# Altium project IGBT_Module_Driver.PrjPcb
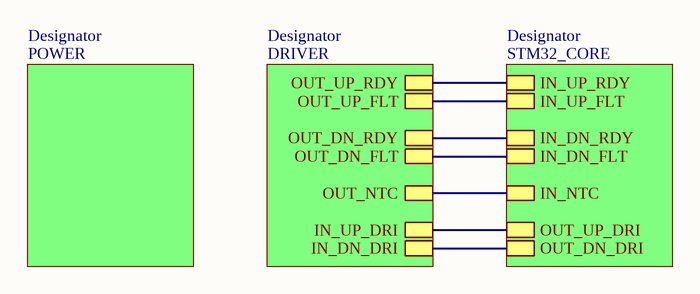
[diagram p0: Top.SchDoc]
4 sheets, 230 parts. Net scope: hierarchical (ports join the sheet entries above them; power ports are global).
Board file: MODULE_DRIVER.PcbDoc
Sheets:
  Top.SchDoc
    Designator = DRIVER.SchDoc
    Designator = STM32_CORE.SchDoc
    Designator = POWER.SchDoc

## Sheet Top.SchDoc
size A4; SheetNumber: 1; SheetTotal: 4

### Sub-sheets
Designator = DRIVER: OUT_UP_RDY, OUT_UP_FLT, OUT_DN_RDY, OUT_DN_FLT, OUT_NTC, IN_UP_DRI, IN_DN_DRI
Designator = STM32_CORE: IN_UP_RDY, IN_UP_FLT, IN_DN_RDY, IN_DN_FLT, IN_NTC, OUT_UP_DRI, OUT_DN_DRI
Designator = POWER: no entries

### Nets
ADC1_IN4: sheet Designator/OUT_NTC, sheet Designator/IN_NTC
DN_DRI: sheet Designator/IN_DN_DRI, sheet Designator/OUT_DN_DRI
DN_FLT: sheet Designator/OUT_DN_FLT, sheet Designator/IN_DN_FLT
DN_RDY: sheet Designator/OUT_DN_RDY, sheet Designator/IN_DN_RDY
GPI_U_FLT: sheet Designator/OUT_UP_FLT, sheet Designator/IN_UP_FLT
GPI_U_RDY: sheet Designator/OUT_UP_RDY, sheet Designator/IN_UP_RDY
OP_RX: sheet Designator/IN_UP_DRI, sheet Designator/OUT_UP_DRI

## Sheet DRIVER.SchDoc
size A3; SheetNumber: 3; SheetTotal: 4
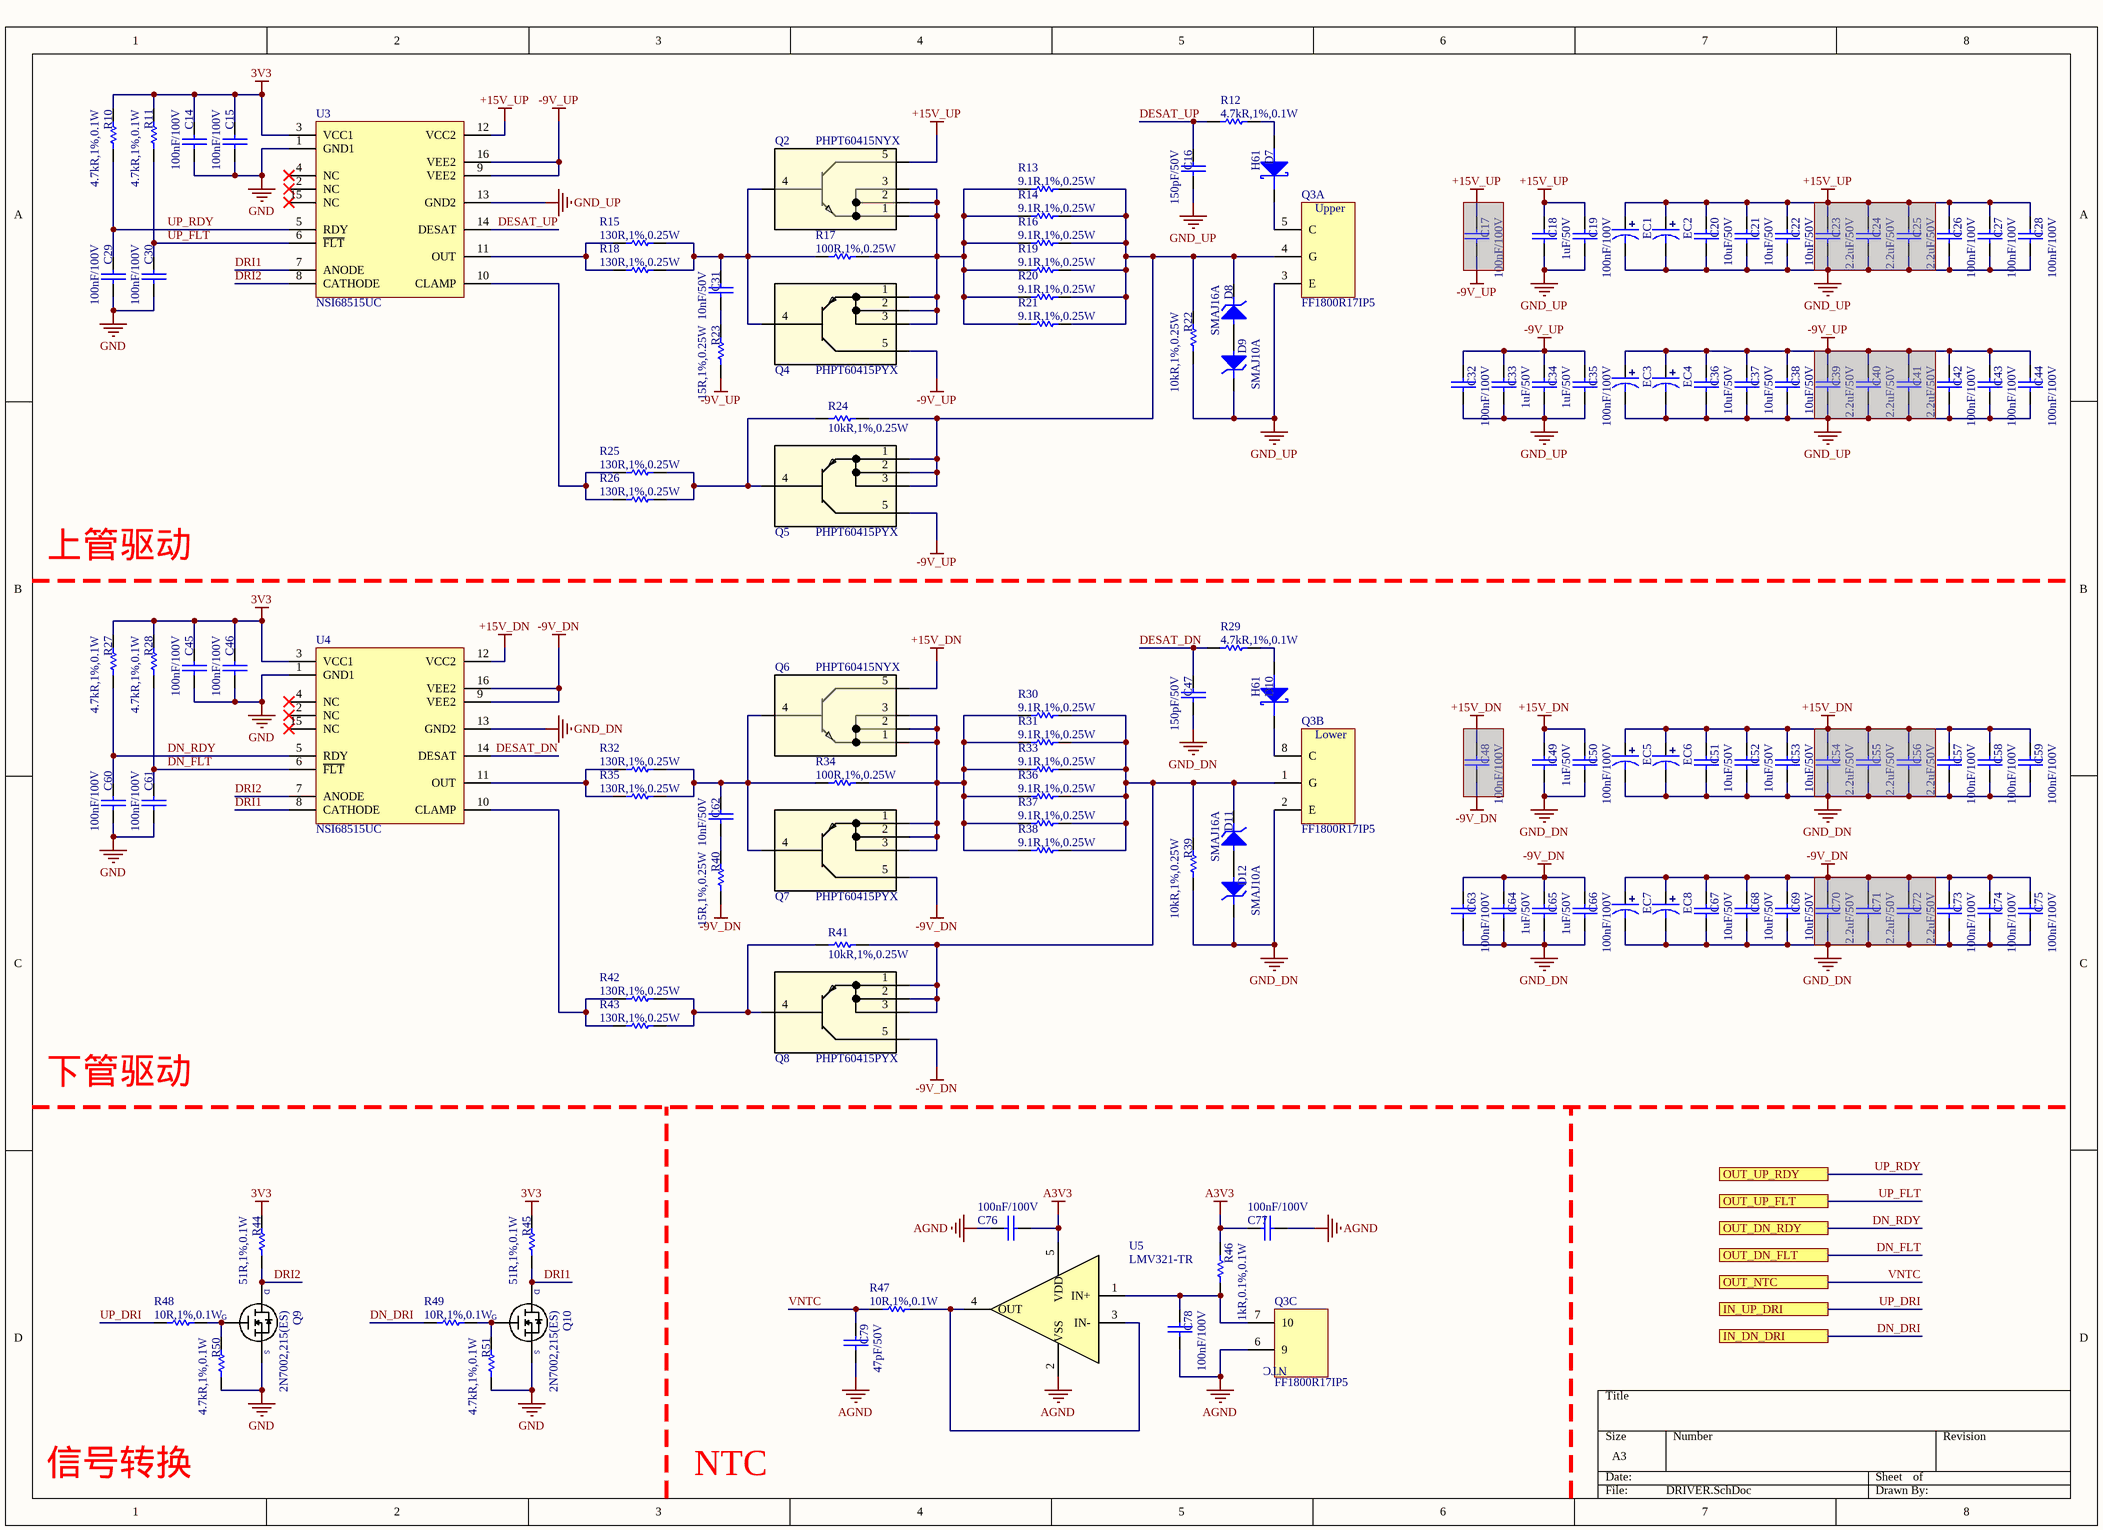
[diagram p1: DRIVER.SchDoc]

### Parts
C14  100nF/100V  [0603C]
C15  100nF/100V  [0603C]
C16  150pF/50V  [0603C]
C17  100nF/100V  [1206C]  (masked out: inside a compile mask, not in the netlist)
C18  1uF/50V  [0603C]
C19  100nF/100V  [0603C]
C20  10uF/50V  [1206C]
C21  10uF/50V  [1206C]
C22  10uF/50V  [1206C]
C23  2.2uF/50V  [1206C]  (masked out: inside a compile mask, not in the netlist)
C24  2.2uF/50V  [1206C]  (masked out: inside a compile mask, not in the netlist)
C25  2.2uF/50V  [1206C]  (masked out: inside a compile mask, not in the netlist)
C26  100nF/100V  [1206C]
C27  100nF/100V  [1206C]
C28  100nF/100V  [1206C]
C29  100nF/100V  [0603C]
C30  100nF/100V  [0603C]
C31  10nF/50V  [1206C]
C32  100nF/100V  [0603C]
C33  1uF/50V  [0603C]
C34  1uF/50V  [0603C]
C35  100nF/100V  [0603C]
C36  10uF/50V  [1206C]
C37  10uF/50V  [1206C]
C38  10uF/50V  [1206C]
C39  2.2uF/50V  [1206C]  (masked out: inside a compile mask, not in the netlist)
C40  2.2uF/50V  [1206C]  (masked out: inside a compile mask, not in the netlist)
C41  2.2uF/50V  [1206C]  (masked out: inside a compile mask, not in the netlist)
C42  100nF/100V  [1206C]
C43  100nF/100V  [1206C]
C44  100nF/100V  [1206C]
C45  100nF/100V  [0603C]
C46  100nF/100V  [0603C]
C47  150pF/50V  [0603C]
C48  100nF/100V  [1206C]  (masked out: inside a compile mask, not in the netlist)
C49  1uF/50V  [0603C]
C50  100nF/100V  [0603C]
C51  10uF/50V  [1206C]
C52  10uF/50V  [1206C]
C53  10uF/50V  [1206C]
C54  2.2uF/50V  [1206C]  (masked out: inside a compile mask, not in the netlist)
C55  2.2uF/50V  [1206C]  (masked out: inside a compile mask, not in the netlist)
C56  2.2uF/50V  [1206C]  (masked out: inside a compile mask, not in the netlist)
C57  100nF/100V  [1206C]
C58  100nF/100V  [1206C]
C59  100nF/100V  [1206C]
C60  100nF/100V  [0603C]
C61  100nF/100V  [0603C]
C62  10nF/50V  [1206C]
C63  100nF/100V  [0603C]
C64  1uF/50V  [0603C]
C65  1uF/50V  [0603C]
C66  100nF/100V  [0603C]
C67  10uF/50V  [1206C]
C68  10uF/50V  [1206C]
C69  10uF/50V  [1206C]
C70  2.2uF/50V  [1206C]  (masked out: inside a compile mask, not in the netlist)
C71  2.2uF/50V  [1206C]  (masked out: inside a compile mask, not in the netlist)
C72  2.2uF/50V  [1206C]  (masked out: inside a compile mask, not in the netlist)
C73  100nF/100V  [1206C]
C74  100nF/100V  [1206C]
C75  100nF/100V  [1206C]
C76  100nF/100V  [0603C]
C77  100nF/100V  [0603C]
C78  100nF/100V  [0603C]
C79  47pF/50V  [0603C]
D7  H61  [SOD-123]
D8  SMAJ16A  [SMA/DO-214AC]
D9  SMAJ10A  [SMA/DO-214AC]
D10  H61  [SOD-123]
D11  SMAJ16A  [SMA/DO-214AC]
D12  SMAJ10A  [SMA/DO-214AC]
EC1  MA25V470M8x10  [CAPAE830X1050L275X95N]  (value not drawn)
EC2  MA25V470M8x10  [CAPAE830X1050L275X95N]  (value not drawn)
EC3  MA25V470M8x10  [CAPAE830X1050L275X95N]  (value not drawn)
EC4  MA25V470M8x10  [CAPAE830X1050L275X95N]  (value not drawn)
EC5  MA25V470M8x10  [CAPAE830X1050L275X95N]  (value not drawn)
EC6  MA25V470M8x10  [CAPAE830X1050L275X95N]  (value not drawn)
EC7  MA25V470M8x10  [CAPAE830X1050L275X95N]  (value not drawn)
EC8  MA25V470M8x10  [CAPAE830X1050L275X95N]  (value not drawn)
Q2  PHPT60415NYX  [LFPAK56_SOT669_NEX]
Q3  FF1800R17IP5  [FF1800R17IP5]  (parts A,B,C of 3)
Q4  PHPT60415PYX  [LFPAK56_SOT669_NEX]
Q5  PHPT60415PYX  [LFPAK56_SOT669_NEX]
Q6  PHPT60415NYX  [LFPAK56_SOT669_NEX]
Q7  PHPT60415PYX  [LFPAK56_SOT669_NEX]
Q8  PHPT60415PYX  [LFPAK56_SOT669_NEX]
Q9  2N7002,215(ES)  [SOT23]
Q10  2N7002,215(ES)  [SOT23]
R10  4.7kR,1%,0.1W  [0603R]
R11  4.7kR,1%,0.1W  [0603R]
R12  4.7kR,1%,0.1W  [0603R]
R13  9.1R,1%,0.25W  [1206R]
R14  9.1R,1%,0.25W  [1206R]
R15  130R,1%,0.25W  [1206R]
R16  9.1R,1%,0.25W  [1206R]
R17  100R,1%,0.25W  [1206R]
R18  130R,1%,0.25W  [1206R]
R19  9.1R,1%,0.25W  [1206R]
R20  9.1R,1%,0.25W  [1206R]
R21  9.1R,1%,0.25W  [1206R]
R22  10kR,1%,0.25W  [1206R]
R23  15R,1%,0.25W  [1206R]
R24  10kR,1%,0.25W  [1206R]
R25  130R,1%,0.25W  [1206R]
R26  130R,1%,0.25W  [1206R]
R27  4.7kR,1%,0.1W  [0603R]
R28  4.7kR,1%,0.1W  [0603R]
R29  4.7kR,1%,0.1W  [0603R]
R30  9.1R,1%,0.25W  [1206R]
R31  9.1R,1%,0.25W  [1206R]
R32  130R,1%,0.25W  [1206R]
R33  9.1R,1%,0.25W  [1206R]
R34  100R,1%,0.25W  [1206R]
R35  130R,1%,0.25W  [1206R]
R36  9.1R,1%,0.25W  [1206R]
R37  9.1R,1%,0.25W  [1206R]
R38  9.1R,1%,0.25W  [1206R]
R39  10kR,1%,0.25W  [1206R]
R40  15R,1%,0.25W  [1206R]
R41  10kR,1%,0.25W  [1206R]
R42  130R,1%,0.25W  [1206R]
R43  130R,1%,0.25W  [1206R]
R44  51R,1%,0.1W  [0603R]
R45  51R,1%,0.1W  [0603R]
R46  1kR,0.1%,0.1W  [0603R]
R47  10R,1%,0.1W  [0603R]
R48  10R,1%,0.1W  [0603R]
R49  10R,1%,0.1W  [0603R]
R50  4.7kR,1%,0.1W  [0603R]
R51  4.7kR,1%,0.1W  [0603R]
U3  NSI68515UC  [SOIC16P127_1030X1030X265L70X39N]
U4  NSI68515UC  [SOIC16P127_1030X1030X265L70X39N]
U5  LMV321-TR  [SOT23-5P95_292X280X125L45X40N]

### Ports
IN_DN_DRI (see Top[2B]), IN_UP_DRI (see Top[2B]), OUT_DN_FLT (see Top[2B]), OUT_DN_RDY (see Top[2B]), OUT_NTC (see Top[2B]), OUT_UP_FLT (see Top[2A]), OUT_UP_RDY (see Top[2A])

### Nets
3V3: C14.1 C15.1 C45.1 C46.1 R10.2 R11.2 R27.2 R28.2 R44.1 R45.1 U3.3(VCC1) U4.3(VCC1)
+15V_DN: C49.2 C50.1 Q6.5(COLLECTOR) U4.12(VCC2)
+15V_UP: C18.2 C19.1 Q2.5(COLLECTOR) U3.12(VCC2)
-9V_DN: C63.1 C64.2 C65.2 C66.1 Q7.5(COLLECTOR) Q8.5(COLLECTOR) R40.1 U4.9(VEE2) U4.16(VEE2)
-9V_UP: C32.1 C33.2 C34.2 C35.1 Q4.5(COLLECTOR) Q5.5(COLLECTOR) R23.1 U3.9(VEE2) U3.16(VEE2)
A3V3: C76.2 C77.1 R46.2 U5.5(VDD)
AGND: C76.1 C77.2 C78.1 C79.1 Q3.6(9) U5.2(VSS)
GND: C14.2 C15.2 C29.1 C30.1 C45.2 C46.2 C60.1 C61.1 Q9.3 Q10.3 R50.1 R51.1 U3.1(GND1) U4.1(GND1)
GND_DN: C47.1 C49.1 C50.2 C63.2 C64.1 C65.1 C66.2 D12.K Q3.2(E) R39.1 U4.13(GND2)
GND_UP: C16.1 C18.1 C19.2 C32.2 C33.1 C34.1 C35.2 D9.K Q3.3(E) R22.1 U3.13(GND2)
DESAT_DN: C47.2 R29.2 U4.14(DESAT)
DESAT_UP: C16.2 R12.2 U3.14(DESAT)
DN_DRI: R49.2 ; port IN_DN_DRI
DN_FLT: C61.2 R28.1 U4.6(~{FLT}) ; port OUT_DN_FLT
DN_RDY: C60.2 R27.1 U4.5(RDY) ; port OUT_DN_RDY
DRI1: Q10.2 R45.2 U3.7(ANODE) U4.8(CATHODE)
DRI2: Q9.2 R44.2 U3.8(CATHODE) U4.7(ANODE)
UP_DRI: R48.2 ; port IN_UP_DRI  [project net OP_RX]
UP_FLT: C30.2 R11.1 U3.6(~{FLT}) ; port OUT_UP_FLT  [project net GPI_U_FLT]
UP_RDY: C29.2 R10.1 U3.5(RDY) ; port OUT_UP_RDY  [project net GPI_U_RDY]
VNTC: C79.2 R47.2 ; port OUT_NTC  [project net ADC1_IN4]
NetC20_1: C20.1 C21.1 C22.1 C26.1 C27.1 C28.1 EC1.2 EC2.2
NetC20_2: C20.2 C21.2 C22.2 C26.2 C27.2 C28.2 EC1.1 EC2.1
NetC31_1: C31.1 R23.2
NetC31_2: C31.2 Q2.4(BASE) Q4.4(BASE) R15.2 R17.1 R18.2
NetC36_1: C36.1 C37.1 C38.1 C42.1 C43.1 C44.1 EC3.2 EC4.2
NetC36_2: C36.2 C37.2 C38.2 C42.2 C43.2 C44.2 EC3.1 EC4.1
NetC51_1: C51.1 C52.1 C53.1 C57.1 C58.1 C59.1 EC5.2 EC6.2
NetC51_2: C51.2 C52.2 C53.2 C57.2 C58.2 C59.2 EC5.1 EC6.1
NetC62_1: C62.1 R40.2
NetC62_2: C62.2 Q6.4(BASE) Q7.4(BASE) R32.2 R34.1 R35.2
NetC67_1: C67.1 C68.1 C69.1 C73.1 C74.1 C75.1 EC7.2 EC8.2
NetC67_2: C67.2 C68.2 C69.2 C73.2 C74.2 C75.2 EC7.1 EC8.1
NetC78_2: C78.2 Q3.7(10) R46.1 U5.1(IN+)
NetD7_A: D7.A R12.1
NetD7_K: D7.K Q3.5(C)
NetD8_A: D8.A D9.A
NetD8_K: D8.K Q3.4(G) Q5.1(EMITTER) Q5.2(EMITTER) Q5.3(EMITTER) R13.2 R14.2 R16.2 R19.2 R20.2 R21.2 R22.2 R24.1
NetD10_A: D10.A R29.1
NetD10_K: D10.K Q3.8(C)
NetD11_A: D11.A D12.A
NetD11_K: D11.K Q3.1(G) Q8.1(EMITTER) Q8.2(EMITTER) Q8.3(EMITTER) R30.2 R31.2 R33.2 R36.2 R37.2 R38.2 R39.2 R41.1
NetQ2_1: Q2.1(EMITTER) Q2.2(EMITTER) Q2.3(EMITTER) Q4.1(EMITTER) Q4.2(EMITTER) Q4.3(EMITTER) R13.1 R14.1 R16.1 R17.2 R19.1 R20.1 R21.1
NetQ5_4: Q5.4(BASE) R24.2 R25.2 R26.2
NetQ6_1: Q6.1(EMITTER) Q6.2(EMITTER) Q6.3(EMITTER) Q7.1(EMITTER) Q7.2(EMITTER) Q7.3(EMITTER) R30.1 R31.1 R33.1 R34.2 R36.1 R37.1 R38.1
NetQ8_4: Q8.4(BASE) R41.2 R42.2 R43.2
NetQ9_1: Q9.1 R48.1 R50.2
NetQ10_1: Q10.1 R49.1 R51.2
NetR15_1: R15.1 R18.1 U3.11(OUT)
NetR25_1: R25.1 R26.1 U3.10(CLAMP)
NetR32_1: R32.1 R35.1 U4.11(OUT)
NetR42_1: R42.1 R43.1 U4.10(CLAMP)
NetR47_1: R47.1 U5.3(IN-) U5.4(OUT)

Not connected (* = marked no-connect by the designer): U3 2(NC)* 4(NC)* 15(NC)*; U4 2(NC)* 4(NC)* 15(NC)*

### Notes on the sheet
- 上管驱动
- 下管驱动
- 信号转换
- NTC
- (in symbol FF1800R17IP5, part A) Upper
- (in symbol FF1800R17IP5, part B) Lower
- (in symbol FF1800R17IP5, part C) NTC
- (in symbol MOS-3P) D; G; S

### Library data of the parts
C14 C15 C19 C29 C30 C32 C35 C45 C46 C50 C60 C61 C63 C66 C76-C78 = CAP: CC0603KRX7R9BB104
C16 C47 = CAP: CC0603KRX7R9BB151
C17 C26-C28 C42-C44 C48 C57-C59 C73-C75 = CAP: CC1206KKX7R0BB104
C18 C33 C34 C49 C64 C65 = CAP: CC0603KRX7R9BB105
C20-C22 C36-C38 C51-C53 C67-C69 = CAP: CC1206KKX5R9BB106
C23-C25 C39-C41 C54-C56 C70-C72 = CAP: CC1206KKX7R9BB225
C31 C62 = CAP: CC1206KRX7R9BB103
C79 = CAP: CC0603FRNPO9BN470
D7 D10 = DIODE SCHOTTKY: 1.1V@1.0A，耐压1.6kV，trr=70ns
D8 D9 D11 D12 = TVS: 单向瞬态抑制二极管
EC1-EC8 = SMD_ECAP: 470uF@25V， Iripple = 4.1A
Q2 Q6 = PHPT60415NYX: No Description Available; Manufacturer_Name: Nexperia; Manufacturer_Part_Number: PHPT60410NYX; Type: Transistors; Copyright: Copyright (C) 2025 Ultra Librarian. All rights reserved.; RefDes: RefDes
Q3 = FF1800R17IP5: IGBT Module
Q4 Q5 Q7 Q8 = PHPT60415PYX: No Description Available; Manufacturer_Name: Nexperia; Type: Transistors; Copyright: Copyright (C) 2025 Ultra Librarian. All rights reserved.; Manufacturer_Part_Number: PHPT60415PYX; RefDes: RefDes
Q9 Q10 = MOS-3P
R10-R12 R27-R29 R47-R51 = RES: RC0603FR-074K7L
R13 R14 R16 R19-R21 R30 R31 R33 R36-R38 = RES: RC1206FR-079R1L
R15 R18 R25 R26 R32 R35 R42 R43 = RES: RC1206FR-07130RL
R17 R34 = RES: RC1206FR-07100RL
R22 R24 R39 R41 = RES: RC1206FR-0710KL
R23 R40 = RES: RC1206FR-0715RL
R44 R45 = RES: RC0603FR-0751RL
R46 = RES: RT0603BRD071KL
U3 U4 = NSI68515UC: Driver IC
U5 = LMV321-TR: 轨到轨运算放大器

## Sheet STM32_CORE.SchDoc
size A4; SheetNumber: 2; SheetTotal: 4
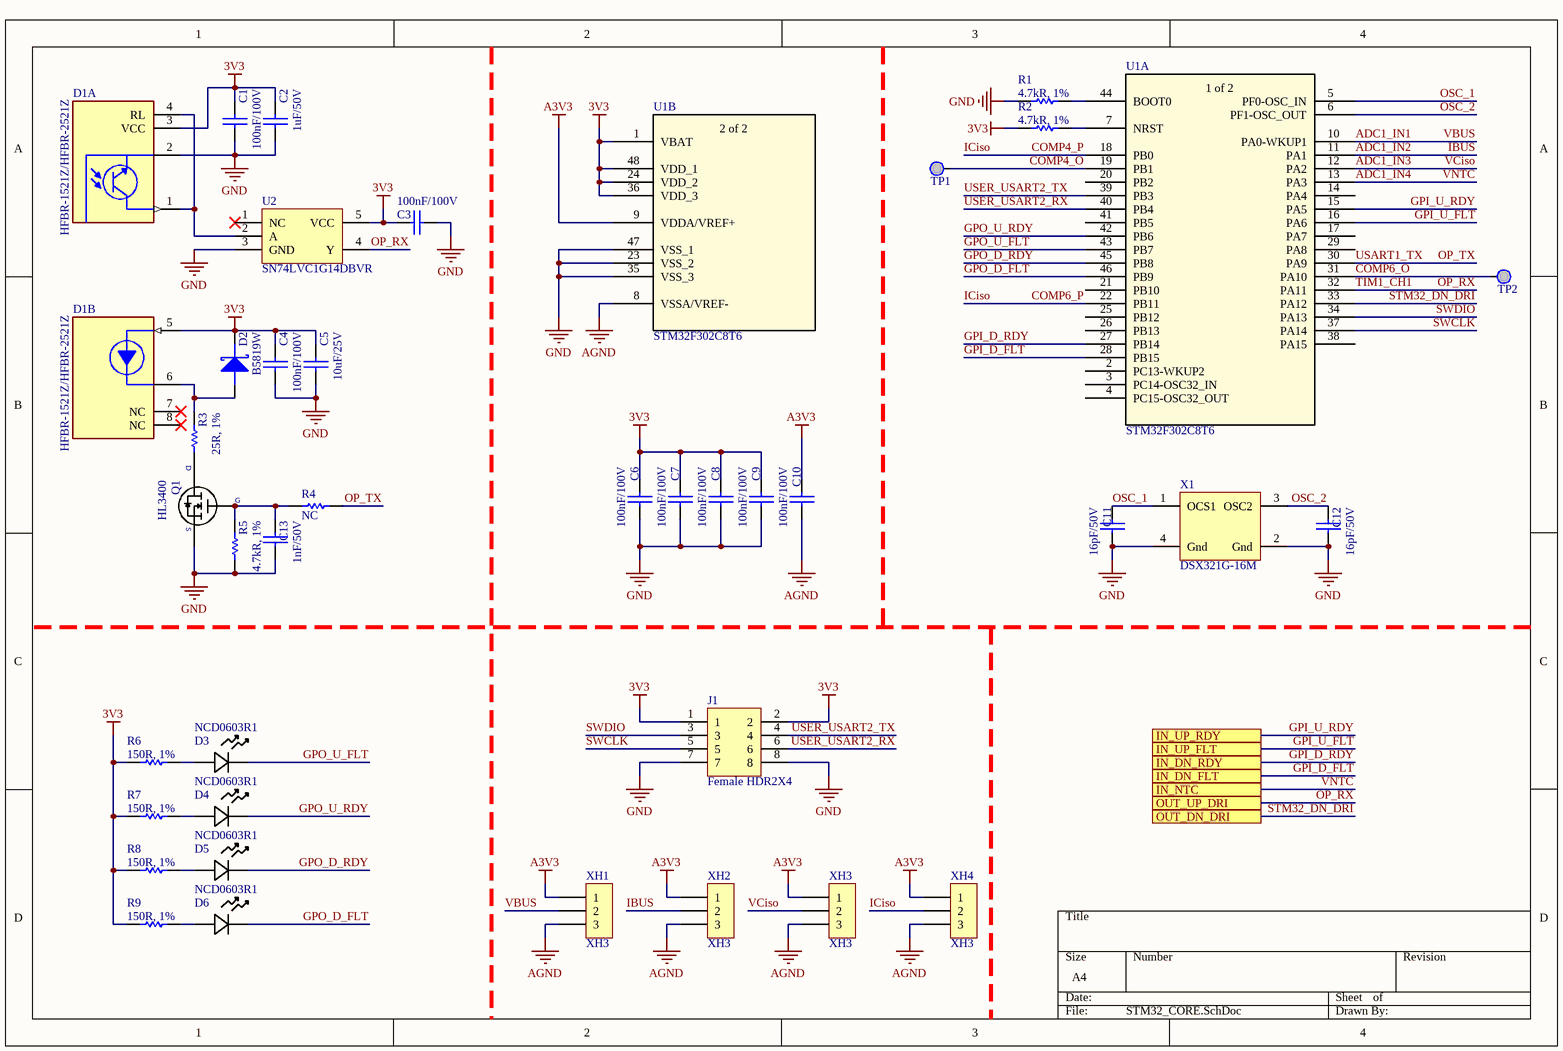
[diagram p2: STM32_CORE.SchDoc]

### Parts
C1  100nF/100V  [0603C]
C2  1uF/50V  [0603C]
C3  100nF/100V  [0603C]
C4  100nF/100V  [0603C]
C5  10uF/25V  [0603C]
C6  100nF/100V  [0603C]
C7  100nF/100V  [0603C]
C8  100nF/100V  [0603C]
C9  100nF/100V  [0603C]
C10  100nF/100V  [0603C]
C11  16pF/50V  [0603C]
C12  16pF/50V  [0603C]
C13  1nF/50V  [0603C]
D1  HFBR-1521Z/HFBR-2521Z  [HFBR_XX21Z_UNION]  (parts A,B of 2)
D2  B5819W  [SOD-123]
D3  NCD0603R1  [LED_LSQ976_OSR]
D4  NCD0603R1  [LED_LSQ976_OSR]
D5  NCD0603R1  [LED_LSQ976_OSR]
D6  NCD0603R1  [LED_LSQ976_OSR]
J1  Female HDR2X4  [Fe-HDR2X4/2.54-S]
Q1  HL3400  [SOT23-3]
R1  4.7kR, 1%  [0603R]
R2  4.7kR, 1%  [0603R]
R3  25R, 1%  [0603R]
R4  NC  [0603R]
R5  4.7kR, 1%  [0603R]
R6  150R, 1%  [0603R]
R7  150R, 1%  [0603R]
R8  150R, 1%  [0603R]
R9  150R, 1%  [0603R]
TP1  Test Point  [TP]  (value not drawn)  (no BOM)
TP2  Test Point  [TP]  (value not drawn)  (no BOM)
U1  STM32F302C8T6  [LQFP48-7x7mm]  (parts A,B of 2)
U2  SN74LVC1G14DBVR  [SOT23-5]
X1  DSX321G-16M  [SMD3225-4]
XH1  XH3  [XH3/2.54mm/180]
XH2  XH3  [XH3/2.54mm/180]
XH3  XH3  [XH3/2.54mm/180]
XH4  XH3  [XH3/2.54mm/180]

### Ports
IN_DN_FLT (see Top[2B]), IN_DN_RDY (see Top[2B]), IN_NTC (see Top[2B]), IN_UP_FLT (see Top[2A]), IN_UP_RDY (see Top[2A]), OUT_DN_DRI (see Top[2B]), OUT_UP_DRI (see Top[2B])

### Nets
3V3: C1.1 C2.2 C3.1 C4.1 C5.1 C6.1 C7.1 C8.1 C9.1 D1.3(VCC) D1.5(VO) D2.K J1.1 J1.2 R2.1 R6.1 R7.1 R8.1 R9.1 U1.1(VBAT) U1.24(VDD_2) U1.36(VDD_3) U1.48(VDD_1) U2.5(VCC)
A3V3: C10.1 U1.9(VDDA/VREF+) XH1.1 XH2.1 XH3.1 XH4.1
AGND: C10.2 U1.8(VSSA/VREF-) XH1.3 XH2.3 XH3.3 XH4.3
GND: C1.2 C2.1 C3.2 C4.2 C5.2 C6.2 C7.2 C8.2 C9.2 C11.1 C12.2 C13.1 D1.2(GROUND) J1.7 J1.8 Q1.2 R1.1 R5.1 U1.23(VSS_2) U1.35(VSS_3) U1.47(VSS_1) U2.3(GND) X1.2(Gnd) X1.4(Gnd)
ADC1_IN1: U1.10(PA0-WKUP1) XH1.2  [also labelled VBUS]
ADC1_IN2: U1.11(PA1) XH2.2  [also labelled IBUS]
ADC1_IN3: U1.12(PA2) XH3.2  [also labelled VCiso]
ADC1_IN4: U1.13(PA3) ; port IN_NTC  [also labelled VNTC]
COMP4_O: TP1.1 U1.19(PB1)
COMP4_P: U1.18(PB0) U1.22(PB11) XH4.2  [also labelled COMP6_P, ICiso]
COMP6_O: TP2.1 U1.31(PA10)
GPI_D_FLT: U1.28(PB15) ; port IN_DN_FLT  [project net DN_FLT]
GPI_D_RDY: U1.27(PB14) ; port IN_DN_RDY  [project net DN_RDY]
GPI_U_FLT: U1.16(PA6) ; port IN_UP_FLT
GPI_U_RDY: U1.15(PA5) ; port IN_UP_RDY
GPO_D_FLT: D6.1 U1.46(PB9)
GPO_D_RDY: D5.1 U1.45(PB8)
GPO_U_FLT: D3.1 U1.43(PB7)
GPO_U_RDY: D4.1 U1.42(PB6)
OP_RX: U1.32(PA11) U2.4(Y) ; port OUT_UP_DRI  [also labelled TIM1_CH1]
OP_TX: R4.1 U1.30(PA9)  [also labelled USART1_TX]
OSC_1: C11.2 U1.5(PF0-OSC_IN) X1.1(OCS1)
OSC_2: C12.1 U1.6(PF1-OSC_OUT) X1.3(OSC2)
STM32_DN_DRI: U1.33(PA12) ; port OUT_DN_DRI  [project net DN_DRI]
SWCLK: J1.5 U1.37(PA14)
SWDIO: J1.3 U1.34(PA13)
USER_USART2_RX: J1.6 U1.40(PB4)
USER_USART2_TX: J1.4 U1.39(PB3)
NetC13_2: C13.2 Q1.1 R4.2 R5.2
NetD1_1: D1.1(VO) D1.4(RL) U2.2(A)
NetD1_6: D1.6(GROUND) D2.A R3.1
NetD3_2: D3.2 R6.2
NetD4_2: D4.2 R7.2
NetD5_2: D5.2 R8.2
NetD6_2: D6.2 R9.2
NetQ1_3: Q1.3 R3.2
NetR1_2: R1.2 U1.44(BOOT0)
NetR2_2: R2.2 U1.7(NRST)

Not connected (* = marked no-connect by the designer): D1 7(NC)* 8(NC)*; U1 2(PC13-WKUP2) 3(PC14-OSC32_IN) 4(PC15-OSC32_OUT) 14(PA4) 17(PA7) 20(PB2) 21(PB10) 25(PB12) 26(PB13) 29(PA8) 38(PA15) 41(PB5); U2 1(NC)*

### Notes on the sheet
- (in symbol NMOS) D; G; S
- (in symbol STM32F302C8T6, part A) 1 of 2
- (in symbol STM32F302C8T6, part B) 2 of 2

### Library data of the parts
C1 C3 C4 C6-C10 = CAP: CC0603KRX7R9BB104
C2 = CAP: CC0603KRX7R9BB105
C5 = CAP: CC0603MRX5R8BB106
C11 C12 = CAP: CC0603FRNPO9BN160
C13 = CAP: CC0603KRX7R9BB102
D1 = HFBR_XX21Z_UNION: Versatile Link Fiber-Optic Connection
D2 = DIODE SCHOTTKY
D3-D6 = LED: No Description Available; Manufacturer_Name: ams OSRAM; Manufacturer_Part_Number: LSQ976; Copyright: Copyright (C) 2025 Ultra Librarian. All rights reserved.
Q1 = NMOS
R1 R2 R5 = RES: RC0603FR-074K7L
R3 = RES: RP0603BRD0725RL
R4 = RES
R6-R9 = RES: RC0603FR-07150RL
TP1 TP2 = TP
U1 = STM32F302C8T6: Mainstream Mixed signals MCUs Arm Cortex-M4 core with DSP and FPU, 64 Kbytes of Flash memory, 72 MHz CPU, 12-bit ADC 5 MSPS, Comparator, Op-Amp; Manufacturer_Name: STMicroelectronics; Copyright: Copyright (C) 2025 Ultra Librarian. All rights reserved.; Manufacturer_Part_Number: STM32F302C8T6; Datasheet: https://www.st.com/resource/en/datasheet/stm32f302r6.pdf; RefDes: RefDes; Type: Type
U2 = SN74LVC1G14DBVR: Y=A\
X1 = DSX321G-16M: 无源晶振

## Sheet POWER.SchDoc
size A4; SheetNumber: 4; SheetTotal: 4
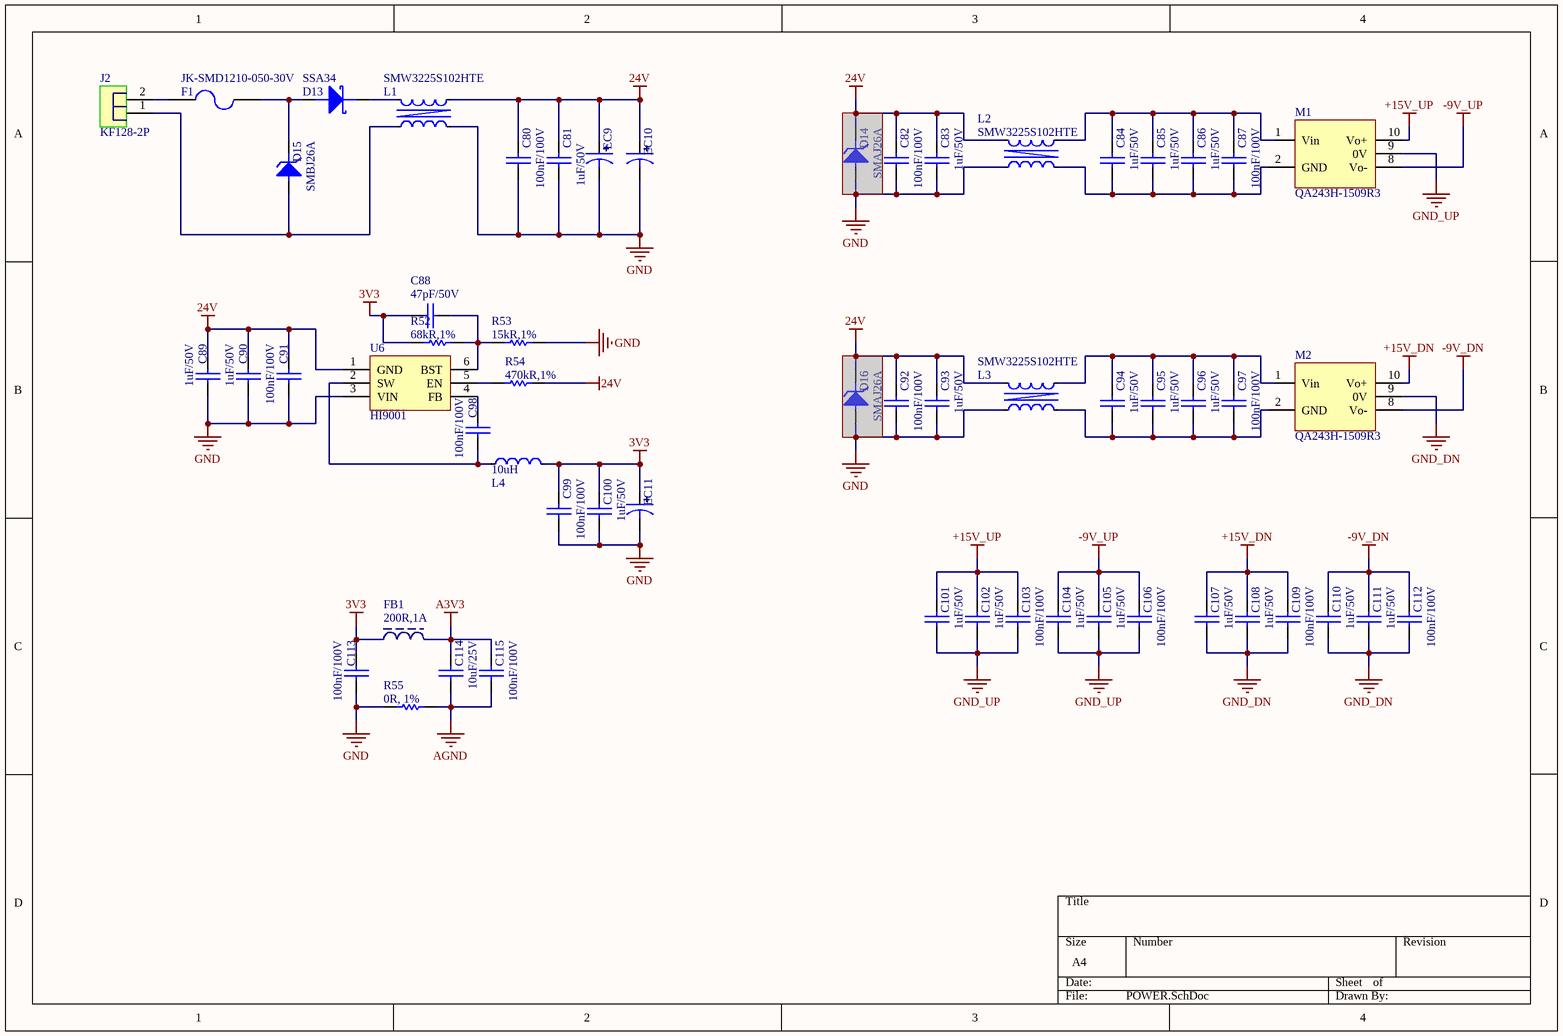
[diagram p3: POWER.SchDoc]

### Parts
C80  100nF/100V  [0603C]
C81  1uF/50V  [0603C]
C82  100nF/100V  [0603C]
C83  1uF/50V  [0603C]
C84  1uF/50V  [0603C]
C85  1uF/50V  [0603C]
C86  1uF/50V  [0603C]
C87  100nF/100V  [0603C]
C88  47pF/50V  [0603C]
C89  1uF/50V  [0603C]
C90  1uF/50V  [0603C]
C91  100nF/100V  [1206C]
C92  100nF/100V  [0603C]
C93  1uF/50V  [0603C]
C94  1uF/50V  [0603C]
C95  1uF/50V  [0603C]
C96  1uF/50V  [0603C]
C97  100nF/100V  [0603C]
C98  100nF/100V  [0603C]
C99  100nF/100V  [0603C]
C100  1uF/50V  [0603C]
C101  1uF/50V  [0603C]
C102  1uF/50V  [0603C]
C103  100nF/100V  [0603C]
C104  1uF/50V  [0603C]
C105  1uF/50V  [0603C]
C106  100nF/100V  [0603C]
C107  1uF/50V  [0603C]
C108  1uF/50V  [0603C]
C109  100nF/100V  [0603C]
C110  1uF/50V  [0603C]
C111  1uF/50V  [0603C]
C112  100nF/100V  [0603C]
C113  100nF/100V  [0603C]
C114  10uF/25V  [0603C]
C115  100nF/100V  [0603C]
D13  SSA34  [SMA/DO-214AC]
D14  SMAJ26A  [SMA/DO-214AC]  (masked out: inside a compile mask, not in the netlist)
D15  SMBJ26A  [SMB/DO-214AA]
D16  SMAJ26A  [SMA/DO-214AC]  (masked out: inside a compile mask, not in the netlist)
EC9  MA50V22M6X6  [CAPAE660X650L275X70N]  (value not drawn)
EC10  MA50V22M6X6  [CAPAE660X650L275X70N]  (value not drawn)
EC11  MA50V22M6X6  [CAPAE660X650L275X70N]  (value not drawn)
F1  JK-SMD1210-050-30V  [FUSE-1210]
FB1  200R,1A  [0603]
J2  KF128-2P  [KF128-3.81-2P]
L1  SMW3225S102HTE  [INDDFN4_320X250X240L65X80N]
L2  SMW3225S102HTE  [INDDFN4_320X250X240L65X80N]
L3  SMW3225S102HTE  [INDDFN4_320X250X240L65X80N]
L4  10uH  [L0530]
M1  QA243H-1509R3  [QAxx3H-R3]
M2  QA243H-1509R3  [QAxx3H-R3]
R52  68kR,1%  [0603R]
R53  15kR,1%  [0603R]
R54  470kR,1%  [0603R]
R55  0R, 1%  [0603R]
U6  HI9001  [SOT23-6]

### Nets
3V3: C88.1 C99.1 C100.1 C113.1 EC11.1 FB1.1 L4.2 R52.1
24V: C80.2 C81.1 C82.2 C83.1 C89.1 C90.1 C91.1 C92.2 C93.1 EC9.1 EC10.1 L1.4 L2.2 L3.1 R54.1 U6.1(GND)
+15V_DN: C107.1 C108.1 C109.2 M2.10(Vo+)
+15V_UP: C101.1 C102.1 C103.2 M1.10(Vo+)
-9V_DN: C110.1 C111.1 C112.2 M2.8(Vo-)
-9V_UP: C104.1 C105.1 C106.2 M1.8(Vo-)
A3V3: C114.1 C115.1 FB1.2
AGND: C114.2 C115.2 R55.2
GND: C80.1 C81.2 C82.1 C83.2 C89.2 C90.2 C91.2 C92.1 C93.2 C99.2 C100.2 C113.2 EC9.2 EC10.2 EC11.2 L1.3 L2.1 L3.2 R53.2 R55.1 U6.3(VIN)
GND_DN: C107.2 C108.2 C109.1 C110.2 C111.2 C112.1 M2.9(0V)
GND_UP: C101.2 C102.2 C103.1 C104.2 C105.2 C106.1 M1.9(0V)
NetC84_1: C84.1 C85.1 C86.1 C87.2 L2.3 M1.1(Vin)
NetC84_2: C84.2 C85.2 C86.2 C87.1 L2.4 M1.2(GND)
NetC88_2: C88.2 R52.2 R53.1 U6.6(BST)
NetC94_1: C94.1 C95.1 C96.1 C97.2 L3.4 M2.1(Vin)
NetC94_2: C94.2 C95.2 C96.2 C97.1 L3.3 M2.2(GND)
NetC98_1: C98.1 L4.1 U6.2(SW)
NetC98_2: C98.2 U6.4(FB)
NetD13_A: D13.A D15.K F1.2
NetD13_K: D13.K L1.1
NetD15_A: D15.A J2.1 L1.2
NetF1_1: F1.1 J2.2
NetR54_2: R54.2 U6.5(EN)

### Library data of the parts
C80 C82 C87 C92 C97-C99 C103 C106 C109 C112 C113 C115 = CAP: CC0603KRX7R9BB104
C81 C83-C86 C89 C90 C93-C96 C100-C102 C104 C105 C107 C108 C110 C111 = CAP: CC0603KRX7R9BB105
C88 = CAP: CC0603FRNPO9BN470
C91 = CAP: CC1206KKX7R0BB104
C114 = CAP: CC0603MRX5R8BB106
D13 = DIODE SCHOTTKY: 肖特基二极管
D14-D16 = TVS: 单向瞬态抑制二极管
EC9-EC11 = SMD_ECAP: 22uF@50V， Iripple = 2.65A
F1 = FUSE
FB1 = 磁珠_1: PZ1608D201-1R0TF
J2 = KF128-2P: KF128L-3.81-2P
L1-L3 = SMW3225S102HTE: 1.2A; Manufacturer: cjiang(长江微电); Symbol: FXL0530-100-M; Add into BOM: yes; Value: 10uH; Tolerance: ±20%; Rated Current: 3.2A; Saturation Current (Isat): 3.5A; DC Resistance (DCR): 125mΩ; Type: 一体成型电感; Device: FXL0530-100-M; LCSC Part Name: 10uH ±20% 3.5A; Supplier Part: C177248; Manufacturer Part: FXL0530-100-M; Supplier Footprint: SMD,5.2x5.4mm; JLCPCB Part Class: Extended Part; Datasheet: https://atta.szlcsc.com/upload/public/pdf/source/20240426/3189EA8206330E2108542F9E34E540E7.pdf; Supplier: LCSC; Convert to PCB: yes
L4 = FXL0530-100-M: Manufacturer: cjiang(长江微电); Add into BOM: yes; Tolerance: ±20%; Rated Current: 3.2A; Saturation Current (Isat): 3.5A; DC Resistance (DCR): 125mΩ; Type: 一体成型电感; Symbol: FXL0530-100-M; Device: FXL0530-100-M; LCSC Part Name: 10uH ±20% 3.5A; Supplier Part: C177248; Manufacturer Part: FXL0530-100-M; Supplier Footprint: SMD,5.2x5.4mm; JLCPCB Part Class: Extended Part; Datasheet: https://atta.szlcsc.com/upload/public/pdf/source/20240426/3189EA8206330E2108542F9E34E540E7.pdf; Supplier: LCSC; Convert to PCB: yes; Value: 10uH
M1 M2 = QAxx3H-R3: IN=24VDC, OUT=+15VDC/-9VDC
R52 = RES: RC0603FR-0768KL
R53 = RES: RT0603BRD0715KL
R54 = RES: RC0603FR-07470KL
R55 = RES: RC0603FR-070RL
U6 = HI9001: DC/DC converter controller

## Nets that join several sheets
3V3: DRIVER (12 pins), STM32_CORE (24 pins), POWER (8 pins)
+15V_DN: DRIVER (C49.2 C50.1 Q6.5 U4.12), POWER (C107.1 C108.1 C109.2 M2.10)
+15V_UP: DRIVER (C18.2 C19.1 Q2.5 U3.12), POWER (C101.1 C102.1 C103.2 M1.10)
-9V_DN: DRIVER (9 pins), POWER (C110.1 C111.1 C112.2 M2.8)
-9V_UP: DRIVER (9 pins), POWER (C104.1 C105.1 C106.2 M1.8)
A3V3: DRIVER (C76.2 C77.1 R46.2 U5.5), STM32_CORE (6 pins), POWER (C114.1 C115.1 FB1.2)
AGND: DRIVER (6 pins), STM32_CORE (6 pins), POWER (C114.2 C115.2 R55.2)
GND: DRIVER (14 pins), STM32_CORE (24 pins), POWER (21 pins)
GND_DN: DRIVER (11 pins), POWER (7 pins)
GND_UP: DRIVER (11 pins), POWER (7 pins)
ADC1_IN4: DRIVER (C79.2 R47.2), STM32_CORE (U1.13)
DN_DRI: DRIVER (R49.2), STM32_CORE (U1.33)
DN_FLT: DRIVER (C61.2 R28.1 U4.6), STM32_CORE (U1.28)
DN_RDY: DRIVER (C60.2 R27.1 U4.5), STM32_CORE (U1.27)
GPI_U_FLT: DRIVER (C30.2 R11.1 U3.6), STM32_CORE (U1.16)
GPI_U_RDY: DRIVER (C29.2 R10.1 U3.5), STM32_CORE (U1.15)
OP_RX: DRIVER (R48.2), STM32_CORE (U1.32 U2.4)